# EasyEDA Pro project f1c200s测试板V1.1.eprj, board PCB1
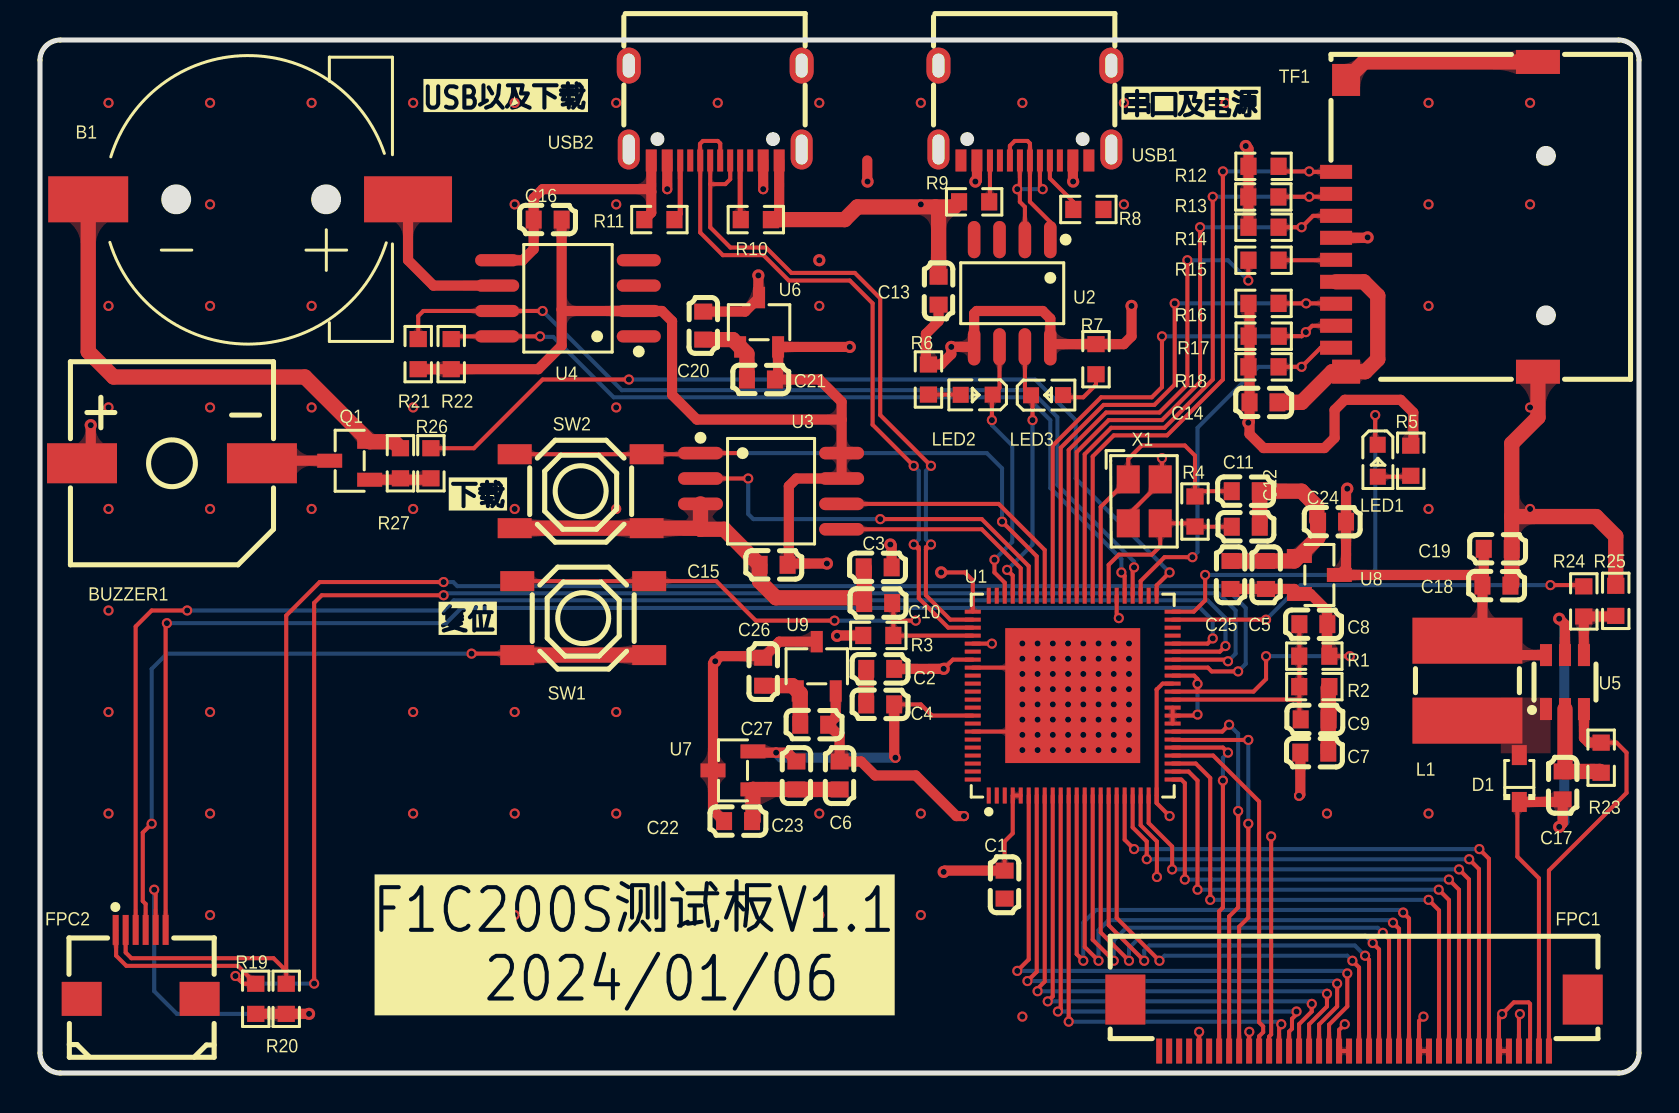
[diagram p1: board, top side]
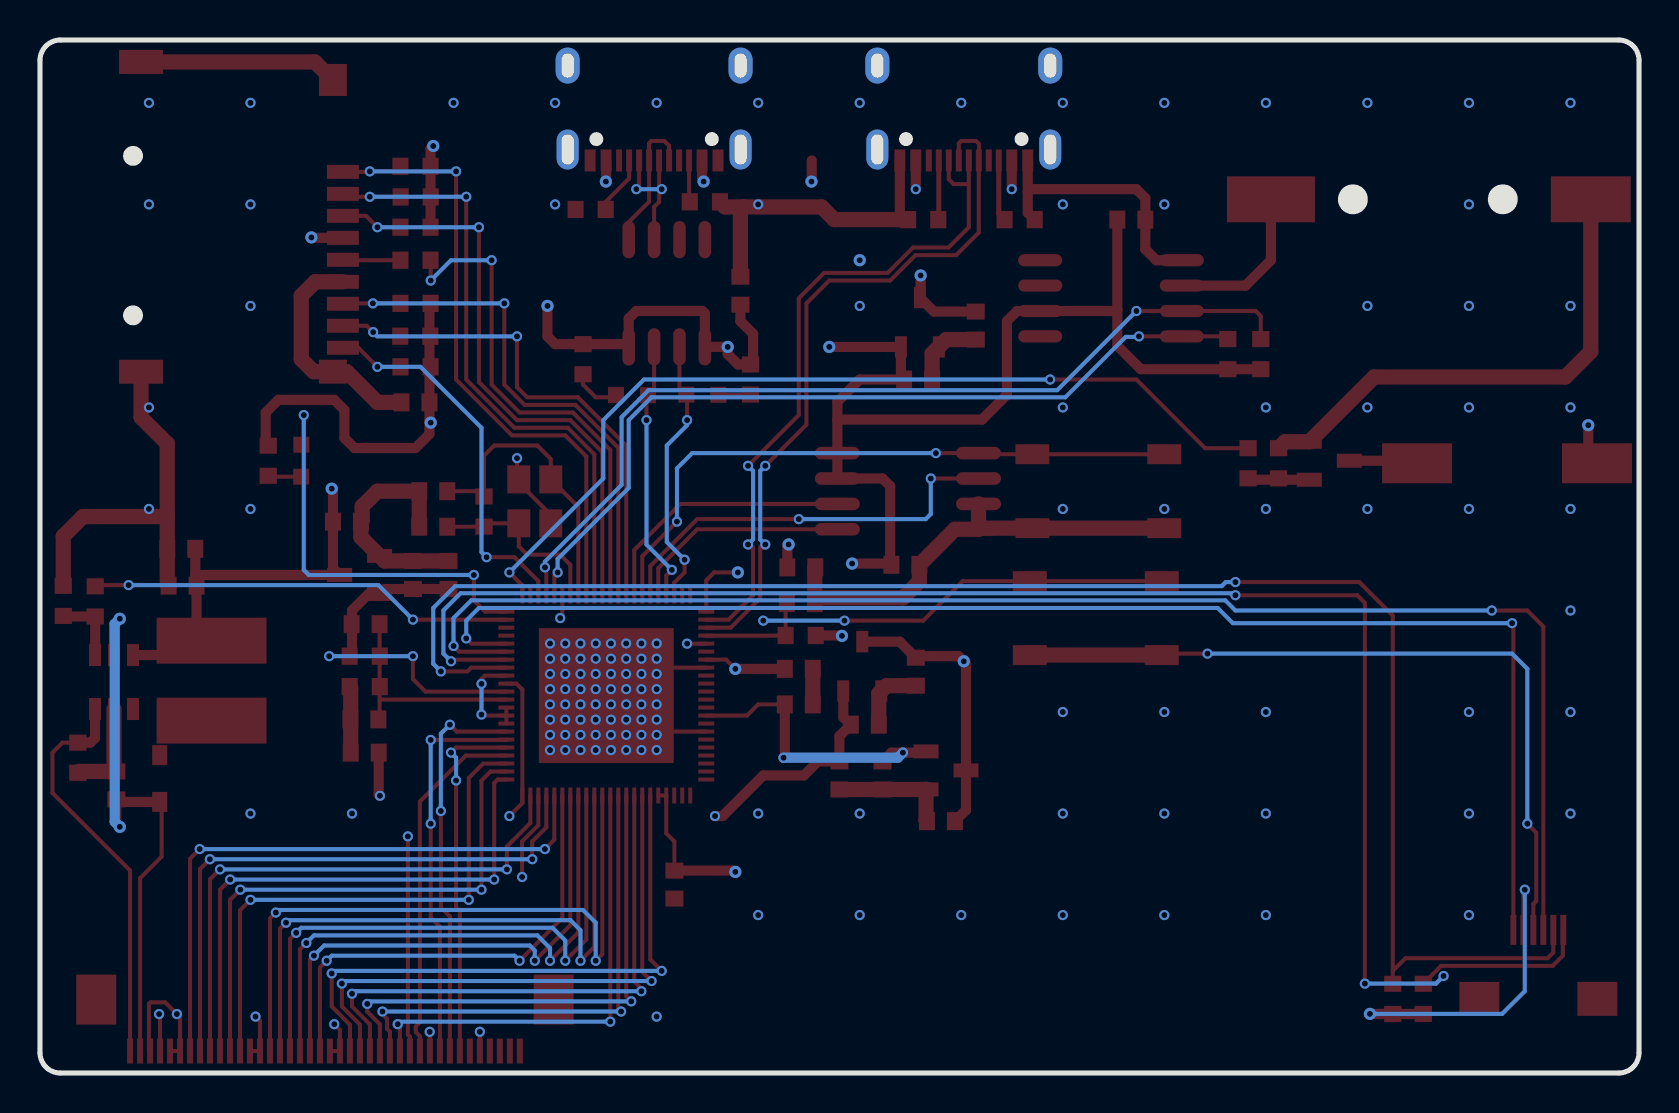
[diagram p2: board, bottom side, seen from below]

Outline 80 x 51.69 mm; copper layers: Top Layer, VCC, GND, Bottom Layer. Coordinates in mm from the lower left corner of the outline.
Outline path: 0,50.67 0,1.02 arc(0.3,0.3) 1.02,0 78.98,0 arc(79.7,0.3) 80,1.02 80,50.67 arc(79.7,51.39) 78.98,51.69 1.02,51.69 arc(0.3,51.39) 0,50.67
Stack: Top Layer 0.035mm 外层铜厚1oz / Dielectric1 0.2104mm 7628 RC49% 8.6mil / VCC 0.0152mm 内层铜厚 / Dielectric2 1.065mm 1.1mm H/HOZ 含铜 / GND 0.0152mm 内层铜厚 / Dielectric3 0.2104mm 7628 RC49% 8.6mil / Bottom Layer 0.035mm 外层铜厚1oz

## Design rules (mm)
template: 自定义配置
spacing copperThickness1oz (default): track to track 0.152, other pairs 0.152 to 0.3
spacing copperThickness2oz: track to track 0.203, other pairs 0.152 to 0.3
track width copperThickness1oz (default): min 0.127, default 0.254, max 2.54
track width copperThickness2oz: min 0.203, default 0.254, max 2.54
differential pair differentialPair (default): width min 0.127, default 0.254, max 2.54; gap min 0.152, default 0.152
via viaSize (default): diameter min 0.5, default 0.508, max 10; hole min 0.305, default 0.305, max 6.299

## Placement (name value [footprint] x y rotation side)
B1  CR1220-2  [BAT-SMD_CR1220-2]  10.41 43.72 180 top
BUZZER1  2700Hz  [BUZ-SMD_L9.6-W9.6-LS10.0-R]  6.6 30.51 180 top
C1  100nF  [C0603]  48.26 9.43 90 top
C2  100nF  [C0603]  42.04 20.22 0 top
C3  100nF  [C0603]  41.91 25.3 0 top
C4  100nF  [C0603]  42.04 18.44 0 top
C5  100nF  [C0603]  61.34 24.92 270 top
C6  100nF  [C0603]  40.01 14.89 90 top
C7  100nF  [C0603]  63.75 16.03 180 top
C8  100nF  [C0603]  63.71 22.46 180 top
C9  100nF  [C0603]  63.77 17.69 180 top
C10  100nF  [C0603]  41.93 23.51 0 top
C11  22pF  [C0603]  60.33 29.11 0 top
C12  22pF  [C0603]  60.33 27.33 180 top
C13  100nF  [C0603]  44.96 39.15 90 top
C14  100nF  [C0603]  61.21 33.56 180 top
C15  100nF  [C0603]  36.7 25.43 180 top
C16  100nF  [C0603]  25.4 42.7 0 top
C17  100nF  [C0603]  76.18 14.39 270 top
C18  100nF  [C0603]  72.87 24.39 180 top
C19  10uF  [C0603]  72.93 26.23 0 top
C20  100nF  [C0603]  33.18 37.4 270 top
C21  10uF  [C0603]  36.07 34.7 0 top
C22  100nF  [C0603]  34.92 12.6 0 top
C23  10uF  [C0603]  37.85 14.89 90 top
C24  100nF  [C0603]  64.64 27.59 180 top
C25  10uF  [C0603]  59.56 24.92 270 top
C26  100nF  [C0603]  36.18 20.08 270 top
C27  10uF  [C0603]  38.73 17.43 0 top
D1  1N5819WS  [SOD-323_L1.8-W1.3-LS2.5-RD]  74.01 14.74 90 top
FPC1  ZX-FPC-FWX0.5PH240  [FPC-SMD_40P-P0.50_MEGASTAR_ZX-FPC-FWX0.5PH240]  65.74 2.39 180 top
FPC2  XW05202-060R-00  [FPC-SMD_XW05202-060R-00]  5.04 5.43 0 top
L1  4.7uH  [IND-SMD_L5.8-W5.2_SLF05XX]  71.42 19.63 90 top
LED1  KT-0603R  [LED0603-RD]  66.93 30.64 270 top
LED2  19-213/Y2C-CQ2R2L/3T(CY)  [LED0603-RD-YELLOW]  46.86 33.94 180 top
LED3  19-217/GHC-YR1S2/3T  [LED0603-RD]  50.38 33.92 0 top
Q1  S9013 J3  [SOT-23-3_L2.9-W1.3-P1.90-LS2.4-BR]  15.49 30.64 0 top
R1  10kΩ  [R0603]  63.75 20.86 180 top
R2  10kΩ  [R0603]  63.75 19.33 180 top
R3  10kΩ  [R0603]  41.94 21.89 180 top
R4  1MΩ  [R0603]  57.79 28.1 270 top
R5  1kΩ  [R0603]  68.58 30.64 270 top
R6  1kΩ  [R0603]  44.45 34.7 270 top
R7  1kΩ  [R0603]  52.83 35.72 270 top
R8  5.1kΩ  [R0603]  52.45 43.21 180 top
R9  5.1kΩ  [R0603]  46.74 43.59 0 top
R10  5.1kΩ  [R0603]  35.81 42.7 180 top
R11  5.1kΩ  [R0603]  30.99 42.7 0 top
R12  10kΩ  [R0603]  61.21 45.37 180 top
R13  10kΩ  [R0603]  61.21 43.84 180 top
R14  10kΩ  [R0603]  61.21 42.32 180 top
R15  33Ω  [R0603]  61.21 40.67 0 top
R16  10kΩ  [R0603]  61.21 38.51 180 top
R17  10kΩ  [R0603]  61.22 36.87 180 top
R18  10kΩ  [R0603]  61.21 35.34 180 top
R19  1kΩ  [R0603]  10.8 3.71 270 top
R20  1kΩ  [R0603]  12.32 3.71 270 top
R21  1kΩ  [R0603]  18.92 35.97 90 top
R22  1kΩ  [R0603]  20.57 35.97 90 top
R23  5.1Ω  [R0603]  78.11 15.78 90 top
R24  1kΩ  [R0603]  77.24 23.6 270 top
R25  10kΩ  [R0603]  78.84 23.63 90 top
R26  1kΩ  [R0603]  19.56 30.51 90 top
R27  10kΩ  [R0603]  18.03 30.51 90 top
SW1  TS-1187A-B-A-B  [SW-SMD_4P-L5.1-W5.1-P3.70-LS6.5-TL-2]  27.18 22.76 0 top
SW2  TS-1187A-B-A-B  [SW-SMD_4P-L5.1-W5.1-P3.70-LS6.5-TL-2]  27.05 29.11 0 top
TF1  TF-CARD H1.8  [TF-SMD_TF-CARD-H1.8]  69.89 42.84 90 top
U1  F1C200S  [QFN-88_L10.0-W10.0-P0.40-BL-EP6.75]  51.67 18.89 0 top
U2  CH340N  [SOP-8_L4.9-W3.9-P1.27-LS6.0-BL]  48.64 39.02 180 top
U3  W25Q128JVSIQ  [SOIC-8_L5.3-W5.3-P1.27-LS8.0-BL]  36.58 29.11 270 top
U4  SD3031  [SOP-8_L5.3-W5.3-P1.27-LS8.0-BL]  26.42 38.76 90 top
U5  MT9284BS6  [SOT-23-6_L2.9-W1.6-P0.95-LS2.8-BR]  76.3 19.56 270 top
U6  XC6206P332MR  [SOT-23-3_L2.9-W1.6-P1.90-LS2.8-BR]  35.98 37.57 270 top
U7  LR6206A-T30  [SOT-23-3_L2.9-W1.3-P1.90-LS2.4-BR]  34.67 15.14 0 top
U8  XC6206P252MR  [SOT-23-3_L2.9-W1.3-P1.90-LS2.4-BR]  64.01 24.92 180 top
U9  LR8103A-T12  [SOT-23-3_L2.9-W1.6-P1.90-LS2.8-BR]  38.86 20.35 270 top
USB1  TYPE-C 16PIN 2MD(073)  [USB-C-SMD_TYPE-C-6PIN-2MD-073]  49.28 48.04 180 top
USB2  TYPE-C 16PIN 2MD(073)  [USB-C-SMD_TYPE-C-6PIN-2MD-073]  33.78 48.04 180 top
X1  24MHz  [CRYSTAL-SMD_4P-L3.2-W2.5-BL-2]  55.24 28.6 270 top

## Footprints (pads in the part's own frame, mm; a bottom-side part is the same pattern mirrored in y, then rotated)
BAT-SMD_CR1220-2
  rect 4.4x2.3 smd: 1(-8,0)
  rect 4x2.3 smd: 2(8,0)
BUZ-SMD_L9.6-W9.6-LS10.0-R
  rect 3.5x2 smd: 1(4.5,0) 2(-4.5,0)
C0603
  rect 0.8x0.9 smd: 1(-0.7,0) 2(0.7,0)
CRYSTAL-SMD_4P-L3.2-W2.5-BL-2
  rect 1.4x1.15 smd: 1(-1.1,-0.8) 2(1.1,-0.8) 3(1.1,0.8) 4(-1.1,0.8)
FPC-SMD_40P-P0.50_MEGASTAR_ZX-FPC-FWX0.5PH240
  rect 0.3x1.25 smd: 1(-9.75,1.288) 2(-9.25,1.288) 3(-8.75,1.288) 4(-8.25,1.288) 5(-7.75,1.288) 6(-7.25,1.288) 7(-6.75,1.288) 8(-6.25,1.288) 9(-5.75,1.288) 10(-5.25,1.288) 11(-4.75,1.288) 12(-4.25,1.288) 13(-3.75,1.288) 14(-3.25,1.288) 15(-2.75,1.288) 16(-2.25,1.288) 17(-1.75,1.288) 18(-1.25,1.288) 19(-0.75,1.288) 20(-0.25,1.288) 21(0.25,1.288) 22(0.75,1.288) 23(1.25,1.288) 24(1.75,1.288) 25(2.25,1.288) 26(2.75,1.288) 27(3.25,1.288) 28(3.75,1.288) 29(4.25,1.288) 30(4.75,1.288) 31(5.25,1.288) 32(5.75,1.288) 33(6.25,1.288) 34(6.75,1.288) 35(7.25,1.288) 36(7.75,1.288) 37(8.25,1.288) 38(8.75,1.288) 39(9.25,1.288) 40(9.75,1.288)
  rect 2x2.5 smd: 41(11.44,-1.288) 42(-11.44,-1.288)
FPC-SMD_XW05202-060R-00
  rect 0.3x1.5 smd: 1(-1.25,1.725) 2(-0.75,1.725) 3(-0.25,1.725) 4(0.25,1.725) 5(0.75,1.725) 6(1.25,1.725)
  rect 2x1.7 smd: 7(2.95,-1.725) 8(-2.95,-1.725)
IND-SMD_L5.8-W5.2_SLF05XX
  rect 2.3x5.5 smd: 1(-2,0) 2(2,0)
LED0603-RD
  rect 0.8x0.8 smd: 1(-0.799,-0.004) 2(0.799,0.004)
LED0603-RD-YELLOW
  rect 0.8x0.8 smd: 1(-0.799,-0.004) 2(0.799,0.004)
QFN-88_L10.0-W10.0-P0.40-BL-EP6.75
  rect 0.2x0.8 smd: 1(-4.2,-5) 2(-3.8,-5) 3(-3.4,-5) 4(-3,-5) 5(-2.6,-5) 6(-2.2,-5) 7(-1.8,-5) 8(-1.4,-5) 9(-1,-5) 10(-0.6,-5) 11(-0.2,-5) 12(0.2,-5) 13(0.6,-5) 14(1,-5) 15(1.4,-5) 16(1.8,-5) 17(2.2,-5) 18(2.6,-5) 19(3,-5) 20(3.4,-5) 21(3.8,-5) 22(4.2,-5) 45(4.2,5) 46(3.8,5) 47(3.4,5) 48(3,5) 49(2.6,5) 50(2.2,5) 51(1.8,5) 52(1.4,5) 53(1,5) 54(0.6,5) 55(0.2,5) 56(-0.2,5) 57(-0.6,5) 58(-1,5) 59(-1.4,5) 60(-1.8,5) 61(-2.2,5) 62(-2.6,5) 63(-3,5) 64(-3.4,5) 65(-3.8,5) 66(-4.2,5)
  rect 0.8x0.2 smd: 23(5,-4.2) 24(5,-3.8) 25(5,-3.4) 26(5,-3) 27(5,-2.6) 28(5,-2.2) 29(5,-1.8) 30(5,-1.4) 31(5,-1) 32(5,-0.6) 33(5,-0.2) 34(5,0.2) 35(5,0.6) 36(5,1) 37(5,1.4) 38(5,1.8) 39(5,2.2) 40(5,2.6) 41(5,3) 42(5,3.4) 43(5,3.8) 44(5,4.2) 67(-5,4.2) 68(-5,3.8) 69(-5,3.4) 70(-5,3) 71(-5,2.6) 72(-5,2.2) 73(-5,1.8) 74(-5,1.4) 75(-5,1) 76(-5,0.6) 77(-5,0.2) 78(-5,-0.2) 79(-5,-0.6) 80(-5,-1) 81(-5,-1.4) 82(-5,-1.8) 83(-5,-2.2) 84(-5,-2.6) 85(-5,-3) 86(-5,-3.4) 87(-5,-3.8) 88(-5,-4.2)
  rect 6.75x6.75 smd: 89(0,0)
R0603
  rect 0.806x0.864 smd: 1(-0.753,0) 2(0.753,0)
SOD-323_L1.8-W1.3-LS2.5-RD
  rect 1x0.75 smd: 1(-1.173,0) 2(1.173,0)
SOIC-8_L5.3-W5.3-P1.27-LS8.0-BL
  oval 0.63x2.25 smd: 1(-1.905,-3.53) 2(-0.635,-3.53) 3(0.635,-3.53) 4(1.905,-3.53) 5(1.905,3.53) 6(0.635,3.53) 7(-0.635,3.53) 8(-1.905,3.53)
SOP-8_L4.9-W3.9-P1.27-LS6.0-BL
  oval 0.63x1.865 smd: 1(-1.905,-2.683) 2(-0.635,-2.683) 3(0.635,-2.683) 4(1.905,-2.683) 5(1.905,2.683) 6(0.635,2.683) 7(-0.635,2.683) 8(-1.905,2.683)
SOP-8_L5.3-W5.3-P1.27-LS8.0-BL
  oval 0.609x2.204 smd: 1(-1.905,-3.542) 2(-0.635,-3.542) 3(0.635,-3.542) 4(1.905,-3.542) 5(1.905,3.542) 6(0.635,3.542) 7(-0.635,3.542) 8(-1.905,3.542)
SOT-23-3_L2.9-W1.3-P1.90-LS2.4-BR
  rect 1.25x0.7 smd: 1(1,-0.95) 2(1,0.95) 3(-1,0)
SOT-23-3_L2.9-W1.6-P1.90-LS2.8-BR
  rect 1.07x0.6 smd: 1(1.235,-0.95) 2(1.235,0.95) 3(-1.235,0)
SOT-23-6_L2.9-W1.6-P0.95-LS2.8-BR
  rect 1.1x0.6 smd: 1(1.35,-0.95) 2(1.35,0) 3(1.35,0.95) 4(-1.35,0.95) 5(-1.35,0) 6(-1.35,-0.95)
SW-SMD_4P-L5.1-W5.1-P3.70-LS6.5-TL-2
  rect 1.7x1 smd: 1(-3.3,1.85) 2(3.3,1.85) 3(-3.3,-1.85) 4(3.3,-1.85)
TF-SMD_TF-CARD-H1.8
  rect 0.7x1.6 smd: 1(2.25,5.05) 2(1.15,5.05) 3(0.05,5.05) 4(-1.05,5.05) 5(-2.15,5.05) 6(-3.25,5.05) 7(-4.35,5.05) 8(-5.45,5.05) 9(-6.55,5.05)
  rect 1.2x1.4 smd: 10(-7.747,4.55)
  rect 1.2x2.2 smd: 11(-7.75,-5.05) 12(7.75,-5.05)
  rect 1.6x1.4 smd: 13(6.85,4.55)
USB-C-SMD_TYPE-C-6PIN-2MD-073
  rect 0.55x1.1 smd: 1(-3.2,2.375) 2(-2.4,2.375) 11(2.4,2.375) 12(3.2,2.375)
  rect 0.3x1.1 smd: 3(-1.75,2.375) 4(-1.25,2.375) 5(-0.75,2.375) 6(-0.25,2.375) 7(0.25,2.375) 8(0.75,2.375) 9(1.25,2.375) 10(1.75,2.375)
  oval 1.1x2 hole 0.6x1.5: 13(-4.325,1.825) 14(4.325,1.825)
  oval 1.2x1.8 hole 0.6x1.2: 13(-4.325,-2.375) 14(4.325,-2.375)

## Nets
As in the schematic.

Pads without a net: FPC1 35 37 38 39 40 41 42; FPC2 7 8; U1 1 2 3 41 42 46 65 66 72 75 76 77 78 79 81 83 84 85 86 87 88; U2 4; U4 1 3 4; USB1 3 9 13 14; USB2 3 9 13 14

## Via types
v1: diameter 0.508, hole 0.305, Top Layer to Bottom Layer, 244 vias
v2: diameter 0.61, hole 0.305, Top Layer to Bottom Layer, 23 vias

## Routing (per net, layer and track width the routed paths; a pad name or vN(x,y) marks a point on that pad's centre or on a via; arc(x,y) is an arc through that point)
+1.2V: length 47.8
  Top Layer w0.203: U1.35 56.17,19.49 55.87,19.19 ; U1.71 v1(47.62,21.49) ; v1(56.52,12.86) 55.87,13.5 U1.22 55.87,19.19 ; 55.87,19.19 55.87,19.2
  Top Layer w0.508: v1(62.99,13.87) 63.05,13.93 C7.2 ; v1(46.23,12.86) 45.85,12.86 43.81,14.89 41.78,14.89 41.08,15.59 C6.2 40.01,16.86 C27.2 39.81,17.81 U9.2
  VCC w0.203: 47.79,12.86 47.62,13.03 v1(47.62,21.49)
  VCC w0.508: v1(46.23,12.86) v1(56.52,12.86) 57.53,12.86 58.55,13.87 v1(62.99,13.87)
+2.5V: length 24.5
  Top Layer w0.203: v1(57.91,17.94) 57.86,17.89 U1.31 ; U1.34 57.89,19.09 ; 57.89,19.09 60.71,19.09 61.34,19.71 v1(61.34,20.86) ; 57.89,19.09 57.91,19.11 57.91,19.71 57.74,19.89 U1.36 ; v1(65.53,20.86) R1.1 ; U1.31 U1.30 ; U1.31 U1.32
  Top Layer w0.508: C25.2 C5.2 62.76,24.22 U8.2 63.56,23.97 64.39,23.14 64.39,20.98 R1.1
  Bottom Layer w0.203: v1(61.34,20.86) v1(65.53,20.86) ; v1(57.91,19.47) v1(57.91,17.94)
+3.0V: length 15.3
  Top Layer w0.203: U1.80 44.63,17.89 44.07,18.44 C4.2
  Top Layer w0.508: U7.2 35.73,16.03 v1(36.83,16.03) 37.4,16.03 C23.2 ; v1(42.8,15.78) 42.74,15.84 C4.2
  Bottom Layer w0.508: v1(36.83,16.03) 37.08,15.78 v1(42.8,15.78)
+3.3V: length 288.8
  Top Layer w0.203: FPC1.31 60.49,2.05 v1(60.5,2.06) ; U1.5 U1.4 48.67,11.99 48.26,11.59 C1.2 ; v2(45.08,25.05) 46.27,25.05 46.67,24.65 U1.67 ; v1(74.04,2.95) 73.99,2.9 FPC1.4 ; U1.20 55.07,12.4 55.88,11.59 v1(55.88,9.81) ; v2(45.21,20.22) 45.67,20.69 U1.73 ; 5.79,7.16 5.79,9.1 v1(5.72,9.17) ; v1(53.98,22.76) 53.87,22.87 U1.50
  Top Layer w0.508: 40.11,32.7 32.86,32.7 31.62,33.94 31.62,37.62 31.11,38.13 U4.2 26.17,38.13 26.1,38.2 ; 40.11,32.7 40.11,33.58 38.99,34.7 C21.2 36.93,34.86 U6.2 v2(40.51,36.33) ; 40.11,32.7 U3.7 37.85,29.75 37.46,29.37 37.46,25.49 ; 60.51,32.6 60.51,31.97 61.21,31.27 64.26,31.27 64.77,31.78 64.77,33.18 65.28,33.68 68.07,33.68 68.71,33.05 68.71,31.52 R5.1 ; 60.51,32.6 C14.2 60.51,38.46 R16.2 ; 60.51,32.6 v2(60.45,32.54) ; C3.2 42.61,26.38 v2(42.55,26.45) ; TF1.4 66.4,41.79 v2(66.42,41.81) ; v2(45.21,10.06) 45.28,10.13 C1.2 ; C2.2 v2(45.21,20.22) ; 37.46,25.49 v2(39.37,25.49) ; 37.46,25.49 C15.1 ; v2(54.61,38.38) 54.61,36.86 54.22,36.47 R7.1 50.68,36.47 U2.8 50.55,37.75 50.17,38.13 46.86,38.13 46.74,38 U2.5 45.6,36.34 v2(45.59,36.33) 45.59,35.97 45.08,35.45 R6.1 44.32,35.58 44.32,36.99 44.96,37.62 C13.1 ; R14.2 R12.2 60.46,46.25 v2(60.33,46.38) ; 26.1,38.2 26.1,36.39 24.93,35.22 R22.1 R21.1 ; 26.1,38.2 C16.2 ; R19.2 R20.2 v2(13.46,2.96) ; R3.2 39.9,21.89 v2(39.88,21.87)
  VCC w0.203: v1(53.98,22.76) 45.21,22.76
  VCC w0.508: v2(66.42,41.81) 66.42,45.37 65.4,46.38 v2(60.33,46.38) 58.04,46.38 56.26,44.61 56.26,39.59 56.2,39.53 ; 56.2,39.53 58.29,39.53 60.45,37.37 v2(60.45,32.54) ; 56.2,39.53 55.75,39.53 v2(54.61,38.38) ; 45.21,21.87 v2(45.21,20.22) v2(45.21,10.06) ; 45.21,21.87 v2(39.88,21.87) ; 45.21,21.87 45.21,24.92 44.96,25.18 43.05,25.18 42.55,25.68 v2(42.55,26.45) 39.75,26.45 39.37,26.06 v2(39.37,25.49) ; v2(40.51,36.33) v2(45.59,36.33) ; v2(45.21,10.06) 45.34,10.19 47.5,10.19 47.88,9.81 v1(55.88,9.81) 57.91,7.78 57.91,6 60.5,3.41 v1(60.5,2.06) 61.27,1.3 72.9,1.3 74.04,2.44 v1(74.04,2.95) ; v2(45.21,10.06) 45.21,3.97 44.2,2.96 v2(13.46,2.96)
  Bottom Layer w0.203: v1(5.72,9.17) 5.72,4.09 6.85,2.96 v2(13.46,2.96)
+5V: length 162
  Top Layer w0.508: v2(46.8,44.61) 46.88,44.68 USB1.11 ; C20.1 35.27,38.1 U6.3 35.94,38.84 v2(35.94,39.91) ; v2(51.69,44.61) 51.68,44.62 USB1.2 ; 72.23,24.98 72.23,24.45 C18.2 72.17,22.38 L1.2 72.14,20.91 U5.6 ; 72.23,24.98 72.17,24.92 65.34,24.92 ; 72.23,24.98 C19.1 ; 41.39,45.66 41.39,44.62 v2(41.4,44.61) ; BUZZER1.1 2.54,30.95 v2(2.54,32.41) ; USB2.2 v1(36.18,44.23) ; USB2.11 v1(31.38,44.23) ; U8.3 65.34,25.26 C24.1 65.34,29.18 v2(65.4,29.24) ; U9.3 36.98,21.58 C26.1 36.1,20.86 34.04,20.86 33.67,20.49 U7.3 33.67,13.16 C22.1
  VCC w0.508: 39,44.23 v1(36.18,44.23) v1(31.38,44.23) ; 39,44.23 38.99,44.21 v2(38.99,40.67) 36.7,40.67 v2(35.94,39.91) 35.94,33.3 35.05,32.41 33.09,32.41 ; 39,44.23 41.02,44.23 v2(41.4,44.61) v2(46.8,44.61) 47.12,44.61 47.62,45.11 50.55,45.11 51.05,44.61 v2(51.69,44.61) 54.48,44.61 57.28,47.4 65.66,47.4 67.56,45.5 67.56,35.84 65.4,33.68 v2(65.4,29.24) ; 33.09,32.41 v2(2.54,32.41) ; 33.09,32.41 33.09,21.3 v2(33.78,20.6)
GND: length 230
  Top Layer w0.203: v1(69.21,2.82) 68.99,2.6 FPC1.14 FPC1.13 ; FPC1.29 61.49,1.83 61.59,1.93 v1(61.59,11.84) ; FPC1.5 FPC1.6 72.99,2.79 v1(73.15,2.95) 73.74,3.54 74.47,3.54 74.55,3.46 74.55,1.16 FPC1.3 ; 23.88,20.91 23.81,20.98 v1(21.59,20.98) ; FPC1.21 FPC1.22 64.99,2.16 v1(65.28,2.44) ; v1(5.59,12.48) 5.14,12.03 5.14,8.6 5.29,8.46 5.29,7.16 ; X1.2 54.45,27.93 56.05,29.53 X1.4 56.13,29.79 v1(56.13,30.76) ; U1.82 49.87,17.09 U1.89 50.27,20.29 U1.74 ; FPC1.36 v1(57.99,2.06)
  Top Layer w0.508: R11.1 30.58,43.05 30.58,44.09 ; USB2.1 36.98,42.77 37.05,42.7 ; 30.58,44.09 30.44,44.23 25.15,44.23 24.7,43.78 C16.1 24.7,41.22 24.15,40.67 U4.5 ; 30.58,44.09 USB2.12
  Top Layer w0.762: 73.63,27.84 C19.2 73.63,24.45 C18.1 ; 73.63,27.84 73.64,27.84 77.85,27.84 78.84,26.86 R25.2 ; 73.63,27.84 73.63,31.5 74.94,32.81 TF1.11 ; C13.2 44.96,43.18 44.8,43.34 ; U3.4 32.99,27.26 SW2.4 SW2.3 ; U3.4 U3.3 ; U3.4 34.23,27.21 C15.2 36,24.6 36.82,23.78 40.97,23.78 C10.1 41.23,25.28 C3.1 ; C12.1 C11.2 63.12,29.11 63.88,28.35 63.88,27.65 C24.2 63.94,26.81 U8.1 62.76,25.62 C5.1 C25.1 ; C6.1 C23.1 35.67,14.19 U7.1 35.67,12.65 C22.2 ; U5.2 76.3,15.21 C17.1 78.04,15.09 R23.1 ; C7.1 64.45,19.28 R2.1 ; C2.1 C4.1 ; B1.2 2.41,36.1 3.68,34.83 13.25,34.83 Q1.2 17.71,31.59 R27.2 ; R9.1 45.73,43.34 44.8,43.34 ; C21.1 35.37,35.99 U6.1 34.66,36.7 C20.2 ; 44.8,43.34 40.89,43.34 40.26,42.7 R10.1 ; 61.91,33.56 63.12,33.56 64.65,35.09 TF1.10 66.31,35.09 66.93,35.72 66.93,38.89 66.23,39.59 TF1.6 ; 23.88,20.91 SW1.4 ; TF1.12 66.24,50.59 TF1.13 ; C26.2 37.65,19.38 38.04,18.99 C27.1
  Bottom Layer w0.203: v1(21.59,20.98) 6.35,20.98 5.59,20.22 v1(5.59,12.48)
  vias: v1(3.43,48.54) v1(3.43,38.38) v1(3.43,33.3) v1(3.43,28.22) v1(3.43,23.14) v1(3.43,18.06) v1(3.43,12.98) v1(8.51,48.54) v1(8.51,43.46) v1(8.51,38.38) v1(8.51,33.3) v1(8.51,28.22) v1(8.51,18.06) v1(8.51,12.98) v1(8.51,7.9) v1(13.59,48.54) v1(13.59,38.38) v1(13.59,33.3) v1(13.59,28.22) v1(18.67,48.54) v1(18.67,33.3) v1(18.67,28.22) v1(18.67,18.06) v1(18.67,12.98) v1(18.67,7.9) v1(23.75,48.54) v1(23.75,43.46) v1(23.75,28.22) v1(23.75,18.06) v1(23.75,12.98) v1(23.75,7.9) v1(28.83,48.54) v1(28.83,43.46) v1(28.83,33.3) v1(28.83,28.22) v1(28.83,18.06) v1(28.83,12.98) v1(28.83,7.9) v1(33.91,48.54) v1(33.91,7.9) v1(38.99,48.54) v1(38.99,38.38) v1(38.99,12.98) v1(38.99,7.9) v1(44.07,48.54) v1(44.07,43.46) v1(44.07,12.98) v1(44.07,7.9) v1(49.15,48.54) v1(49.15,21.49) v1(49.15,20.73) v1(49.15,19.97) v1(49.15,19.21) v1(49.15,18.44) v1(49.15,17.68) v1(49.15,16.92) v1(49.15,16.16) v1(49.15,2.82) v1(49.91,21.49) v1(49.91,20.73) v1(49.91,19.97) v1(49.91,19.21) v1(49.91,18.44) v1(49.91,17.68) v1(49.91,16.92) v1(49.91,16.16) v1(50.67,21.49) v1(50.67,20.73) v1(50.67,19.97) v1(50.67,19.21) v1(50.67,18.44) v1(50.67,17.68) v1(50.67,16.92) v1(50.67,16.16) v1(51.43,21.49) v1(51.43,20.73) v1(51.43,19.97) v1(51.43,19.21) v1(51.43,18.44) v1(51.43,17.68) v1(51.43,16.92) v1(51.43,16.16) v1(52.2,21.49) v1(52.2,20.73) v1(52.2,19.97) v1(52.2,19.21) v1(52.2,18.44) v1(52.2,17.68) v1(52.2,16.92) v1(52.2,16.16) v1(52.96,21.49) v1(52.96,20.73) v1(52.96,19.97) v1(52.96,19.21) v1(52.96,18.44) v1(52.96,17.68) v1(52.96,16.92) v1(52.96,16.16) v1(53.72,21.49) v1(53.72,20.73) v1(53.72,19.97) v1(53.72,19.21) v1(53.72,18.44) v1(53.72,17.68) v1(53.72,16.92) v1(53.72,16.16) v1(54.23,48.54) v1(54.23,43.46) v1(54.48,21.49) v1(54.48,20.73) v1(54.48,19.97) v1(54.48,19.21) v1(54.48,18.44) v1(54.48,17.68) v1(54.48,16.92) v1(54.48,16.16) v1(59.31,48.54) v1(64.39,12.98) v1(69.47,48.54) v1(69.47,43.46) v1(69.47,38.38) v1(69.47,28.22) v1(69.47,12.98) v1(74.55,48.54) v1(74.55,43.46) v1(74.55,33.3) v1(74.55,28.22)
$B1_1: length 8
  Top Layer w0.508: U4.6 19.68,39.4 18.41,40.67 B1.1
$BUZZER1_2: length 3.4
  Top Layer w0.508: BUZZER1.2 11.23,30.64 14.49,30.64
$LED1_2: length 1.7
  Top Layer w0.203: LED1.2 68.53,29.84 R5.2
$LED2_2: length 1.6
  Top Layer w0.203: R6.2 46.05,33.95 LED2.2
$LED3_2: length 2.5
  Top Layer w0.203: LED3.2 51.29,33.81 52.2,33.81 52.83,34.45 R7.2
$Q1_1: length 3.1
  Top Layer w0.508: R26.1 19.49,29.69 Q1.1
$R8_2: length 2.9
  Top Layer w0.203: USB1.4 50.53,44.76 51.7,43.59 R8.2
$R9_2: length 2.1
  Top Layer w0.203: USB1.10 47.53,43.63 R9.2
$R10_2: length 3
  Top Layer w0.254: R10.2 35.03,42.73 USB2.4
$R11_2: length 3.1
  Top Layer w0.254: USB2.10 32.03,42.99 R11.2
$R15_2: length 2.9
  Top Layer w0.203: R15.2 64.82,40.67 TF1.5
$R24_2: length 3.5
  Top Layer w0.508: U5.4 77.24,20.92 R24.2 78.81,22.84 R25.1
BUZZER: length 45.5
  Top Layer w0.203: U1.45 55.87,24.4 v1(56.52,25.05) ; v1(29.46,34.7) 25.15,34.7 21.71,31.26 R26.2
  Bottom Layer w0.203: v1(56.52,25.05) 51.82,29.75 51.82,32.67 49.78,34.7 v1(29.46,34.7)
CH340N_D+: length 7.1
  Top Layer w0.203: USB1.8 48.53,46.4 48.77,46.64 49.4,46.64 49.53,46.51 49.53,45.66 USB1.6 49.53,43.59 50.55,42.57 U2.1
CH340N_D-: length 6.8
  Top Layer w0.203: USB1.7 49.02,45.66 49.02,43.59 49.28,43.34 U2.2 ; USB1.5 50.03,44.36 v1(50.17,44.23)
  Bottom Layer w0.203: v1(48.89,44.23) v1(50.17,44.23)
GT911_INT: length 74.8
  Top Layer w0.203: v1(59.31,21.37) 59.03,21.09 U1.39 ; 4.79,7.16 4.79,22.34 5.59,23.14 v1(7.37,23.14)
  Bottom Layer w0.203: v1(59.31,21.37) 59.31,22.76 58.42,23.65 20.7,23.65 20.19,23.14 v1(7.37,23.14)
GT911_RST: length 71.3
  Top Layer w0.203: v1(6.35,22.51) 6.29,22.45 6.29,7.16 ; U1.40 58.41,21.49 v1(58.67,21.75)
  Bottom Layer w0.203: v1(58.67,21.75) 58.67,22.64 58.04,23.27 21.08,23.27 20.32,22.51 v1(6.35,22.51)
IIC0_SCL: length 85.3
  Top Layer w0.203: 3.79,7.16 3.81,7.14 3.81,5.87 4.32,5.36 9.9,5.36 R19.1 10.17,4.47 v1(9.78,4.86) ; v1(59.44,20.6) 59.35,20.69 U1.38 ; v1(20.19,23.91) 14.1,23.91 13.72,23.52 v1(13.72,4.47)
  Bottom Layer w0.203: v1(20.19,23.91) 20.29,24.01 58.95,24.01 59.82,23.14 59.82,20.98 v1(59.44,20.6) ; v1(9.78,4.86) 10.16,4.47 v1(13.72,4.47)
IIC0_SDA: length 83.9
  Top Layer w0.203: U1.37 58.43,20.29 58.62,20.1 v1(59.94,20.1) ; 12.32,5.11 R20.1 ; 12.32,5.11 11.68,5.74 4.57,5.74 4.29,6.03 4.29,7.16 ; 12.32,5.11 12.32,22.89 14,24.57 v1(20.19,24.57)
  Bottom Layer w0.203: v1(20.19,24.57) 20.68,24.57 20.88,24.36 59.23,24.36 60.33,23.27 60.33,20.48 v1(59.94,20.1)
IIC2_SCL: length 42.1
  Top Layer w0.203: v1(25.02,36.86) 20.71,36.86 R22.2 ; U1.49 54.27,24.88 v1(54.1,25.05)
  Bottom Layer w0.203: v1(25.02,36.86) 25.04,36.83 25.68,36.83 28.7,33.81 49.4,33.81 50.55,32.67 50.55,29.27 54.1,25.72 v1(54.1,25.05)
IIC2_SDA: length 46
  Top Layer w0.203: v1(25.15,38.13) U4.7 19.18,38.13 18.92,37.88 R21.2 ; U1.48 54.67,25.23 v1(54.74,25.3)
  Bottom Layer w0.203: v1(25.15,38.13) 29.11,34.17 49.55,34.17 50.9,32.82 50.9,29.43 54.74,25.59 v1(54.74,25.3)
LCD_BL: length 21.3
  Top Layer w0.203: U1.43 v1(61.34,22.69) ; v1(75.56,24.41) 77.17,24.41 R24.1
  Bottom Layer w0.203: v1(61.34,22.69) 63.07,24.41 v1(75.56,24.41)
LCD_CLK: length 17.9
  Top Layer w0.203: FPC1.30 60.99,1.84 61.2,2.04 61.2,2.33 60.99,2.54 60.99,13.59 58.69,15.89 U1.26
LCD_D2: length 29.8
  Top Layer w0.203: v1(48.89,5.11) 49.47,5.68 U1.6 ; v1(65.4,4.98) 65.4,3.33 64.49,2.42 FPC1.23
  Bottom Layer w0.203: v1(48.89,5.11) 65.28,5.11 v1(65.4,4.98)
LCD_D3: length 28.8
  Top Layer w0.203: FPC1.24 63.99,2.43 64.9,3.33 v1(64.9,4.47) ; v1(49.4,4.6) 49.87,5.07 U1.7
  Bottom Layer w0.203: v1(49.4,4.6) 64.77,4.6 v1(64.9,4.47)
LCD_D4: length 27.7
  Top Layer w0.203: v1(49.91,4.09) 49.91,4.22 50.27,4.58 U1.8 ; v1(64.39,3.97) 64.39,3.33 63.49,2.44 FPC1.25
  Bottom Layer w0.203: v1(64.39,3.97) 64.26,4.09 v1(49.91,4.09)
LCD_D5: length 26.3
  Top Layer w0.203: FPC1.26 62.99,2.44 63.63,3.08 v1(63.63,3.46) ; U1.9 50.67,3.83 v1(50.42,3.59)
  Bottom Layer w0.203: v1(50.42,3.59) 63.5,3.59 v1(63.63,3.46)
LCD_D6: length 24.9
  Top Layer w0.203: 62.93,3.01 62.64,2.71 62.64,2.22 62.49,2.07 FPC1.27 ; U1.10 51.07,3.22 v1(50.93,3.08)
  Bottom Layer w0.203: v1(50.93,3.08) v1(62.86,3.08)
LCD_D7: length 23.4
  Top Layer w0.203: v1(62.1,2.44) 61.99,2.33 FPC1.28 ; v1(51.47,2.57) U1.11
  Bottom Layer w0.203: v1(62.1,2.44) 61.98,2.57 v1(51.47,2.57)
LCD_D10: length 33.7
  Top Layer w0.203: v1(52.2,5.62) 51.87,5.95 U1.12 ; v1(68.2,8.03) 68.49,7.74 FPC1.15
  Bottom Layer w0.203: v1(52.2,5.62) 52.2,7.52 52.83,8.16 68.07,8.16 v1(68.2,8.03)
LCD_D11: length 31.6
  Top Layer w0.203: v1(67.69,7.52) 67.99,7.22 FPC1.16 ; U1.13 52.27,6.31 v1(52.96,5.62)
  Bottom Layer w0.203: v1(67.69,7.52) 67.56,7.65 53.47,7.65 52.96,7.14 v1(52.96,5.62)
LCD_D12: length 29.6
  Top Layer w0.203: v1(67.18,7.01) 67.49,6.7 FPC1.17 ; v1(53.72,5.62) 52.67,6.67 U1.14
  Bottom Layer w0.203: v1(53.72,5.62) 53.72,6.63 54.36,7.27 66.93,7.27 v1(67.18,7.01)
LCD_D13: length 27.6
  Top Layer w0.203: FPC1.18 66.99,6.19 v1(66.67,6.51) ; v1(54.48,5.62) 53.07,7.03 U1.15
  Bottom Layer w0.203: v1(54.48,5.62) 54.48,6.25 55.12,6.89 66.29,6.89 v1(66.67,6.51)
LCD_D14: length 25.7
  Top Layer w0.203: FPC1.19 66.49,5.67 v1(66.29,5.87) ; U1.16 53.47,7.4 v1(55.24,5.62)
  Bottom Layer w0.203: v1(55.24,5.62) 55.24,6.13 55.5,6.38 65.79,6.38 v1(66.29,5.87)
LCD_D15: length 23.7
  Top Layer w0.203: FPC1.20 65.99,5.28 v1(65.66,5.62) ; U1.17 53.87,7.76 v1(56.01,5.62)
  Bottom Layer w0.203: v1(56.01,5.62) 56.26,5.87 65.4,5.87 v1(65.66,5.62)
LCD_D18: length 30.5
  Top Layer w0.203: FPC1.7 72.49,10.72 v1(72.01,11.21) ; U1.18 54.27,11.68 v1(54.74,11.21)
  Bottom Layer w0.203: v1(54.74,11.21) v1(72.01,11.21)
LCD_D19: length 29.4
  Top Layer w0.203: FPC1.8 71.99,10.21 v1(71.5,10.7) ; v1(55.37,10.7) 55.37,11.59 54.67,12.29 U1.19
  Bottom Layer w0.203: v1(55.37,10.7) v1(71.5,10.7)
LCD_D20: length 27.8
  Top Layer w0.203: FPC1.9 71.49,9.69 v1(70.99,10.19) ; U1.21 55.47,12.51 56.64,11.33 v1(56.64,10.19)
  Bottom Layer w0.203: v1(56.64,10.19) v1(70.99,10.19)
LCD_D21: length 27.5
  Top Layer w0.203: v1(70.48,9.68) 70.99,9.17 FPC1.10 ; v1(57.28,9.68) 57.28,14.51 57.1,14.69 U1.23
  Bottom Layer w0.203: v1(70.48,9.68) v1(57.28,9.68)
LCD_D22: length 27.2
  Top Layer w0.203: v1(57.91,9.17) 57.91,14.63 57.46,15.09 U1.24 ; FPC1.11 70.49,8.66 v1(69.98,9.17)
  Bottom Layer w0.203: v1(57.91,9.17) v1(69.98,9.17)
LCD_D23: length 27
  Top Layer w0.203: v1(69.47,8.67) 69.99,8.14 FPC1.12 ; U1.25 57.82,15.49 58.55,14.76 v1(58.55,8.67)
  Bottom Layer w0.203: v1(69.47,8.67) v1(58.55,8.67)
LCD_DE: length 18
  Top Layer w0.203: v1(59.18,14.63) 59.18,8.28 58.99,8.1 FPC1.34 ; U1.27 59.18,16.29 v1(59.44,16.03)
  Bottom Layer w0.203: v1(59.18,14.63) 59.18,15.78 v1(59.44,16.03)
LCD_HSYNC: length 19.6
  Top Layer w0.203: U1.28 56.69,16.67 v1(60.45,16.67) ; v1(60.45,12.48) 60.45,7.78 59.99,7.32 FPC1.32
  Bottom Layer w0.203: v1(60.45,16.67) v1(60.45,12.48)
LCD_VSYNC: length 19.7
  Top Layer w0.203: v1(59.49,17.43) 59.15,17.09 U1.29 ; v1(59.94,13.11) 59.94,8.28 59.49,7.83 FPC1.33
  Bottom Layer w0.203: v1(59.49,17.43) 59.94,16.98 v1(59.94,13.11)
LED_GND: length 20.4
  Top Layer w0.203: R23.2 78.88,16.53 79.37,16.03 79.37,14.02 75.49,10.14 FPC1.1
  Top Layer w0.508: R23.2 77.48,16.53 77.25,16.76 U5.3
LED_VCC: length 29.2
  Top Layer w0.203: D1.1 73.91,13.47 73.91,10.82 74.99,9.75 FPC1.2
  Top Layer w0.508: U5.5 76.3,22.44 v2(76.01,22.73) ; D1.1 76.05,13.56 C17.2 76.18,12.49 v2(76.01,12.32)
  Bottom Layer w0.508: v2(76.01,22.73) 76.26,22.48 76.26,12.57 v2(76.01,12.32)
NRST: length 27.5
  Top Layer w0.203: v1(43.81,22.64) 42.71,22.64 42.7,22.62 ; 42.7,22.62 42.7,23.45 C10.2 ; 42.7,22.62 R3.1 42.7,21.89 U1.70 ; v1(39.75,22.64) 35.81,22.64 33.84,24.61 SW1.2 23.88,24.61
  Bottom Layer w0.203: v1(39.75,22.64) v1(43.81,22.64)
SDIO_CD: length 20.1
  Top Layer w0.203: R18.1 v1(63.12,35.34) 64.07,36.29 TF1.9 ; v1(57.66,25.81) 56.26,25.81 55.07,24.62 U1.47
  Bottom Layer w0.203: v1(57.66,25.81) 57.91,26.06 57.91,32.29 60.96,35.34 v1(63.12,35.34)
SDIO_CK: length 25.3
  Top Layer w0.203: R15.1 60.45,40.66 v1(60.45,39.65) ; v1(57.4,40.67) 57.4,34.45 56.01,33.05 53.34,33.05 51.47,31.18 U1.56
  Bottom Layer w0.203: v1(57.4,40.67) 59.44,40.67 v1(60.45,39.65)
SDIO_CMD: length 30.7
  Top Layer w0.203: v1(58.04,42.32) 58.04,34.57 56.13,32.67 53.47,32.67 51.87,31.07 U1.55 ; TF1.3 63.69,42.89 v1(63.12,42.32) R14.1
  Bottom Layer w0.203: v1(63.12,42.32) v1(58.04,42.32)
SDIO_D0: length 27.9
  Top Layer w0.203: R16.1 v1(63.35,38.51) 64.82,38.51 TF1.7 ; U1.57 51.07,31.28 53.21,33.43 55.75,33.43 56.77,34.45 v1(56.77,38.51)
  Bottom Layer w0.203: v1(56.77,38.51) v1(63.35,38.51)
SDIO_D1: length 27.1
  Top Layer w0.203: TF1.8 63.65,37.39 v1(63.33,37.07) 63.13,36.87 61.98,36.87 ; v1(56.13,36.86) 56.13,34.32 55.63,33.81 53.09,33.81 50.67,31.39 U1.58
  Bottom Layer w0.203: v1(56.13,36.86) 63.12,36.86 v1(63.33,37.07)
SDIO_D2: length 32.8
  Top Layer w0.203: U1.53 52.67,30.85 53.72,31.91 56.39,31.91 59.18,34.7 v1(59.18,45.11) ; TF1.1 63.52,45.09 v1(63.5,45.11) 62.22,45.11 R12.1
  Bottom Layer w0.203: v1(59.18,45.11) v1(63.5,45.11)
SDIO_D3: length 32
  Top Layer w0.203: R13.1 61.97,43.84 v1(63.5,43.84) 64.7,43.84 TF1.2 ; v1(58.67,43.84) 58.67,34.7 56.26,32.29 53.59,32.29 52.27,30.96 U1.54
  Bottom Layer w0.203: v1(58.67,43.84) v1(63.5,43.84)
SPI0_CS: length 31.8
  Top Layer w0.203: v1(48.13,27.59) 49.87,25.85 U1.60 ; v1(35.18,31.02) 33.05,31.02 32.99,30.96 SW2.2 SW2.1
  Bottom Layer w0.203: v1(35.18,31.02) 47.37,31.02 48.13,30.26 v1(48.13,27.59)
SPI0_MISO: length 20.8
  Top Layer w0.203: U1.61 49.47,25.37 47.12,27.72 v1(42.04,27.72) ; v1(35.43,29.75) U3.2
  Bottom Layer w0.203: v1(42.04,27.72) 35.69,27.72 35.43,27.97 v1(35.43,29.75)
SPI0_MOSI: length 11.1
  Top Layer w0.203: U1.62 49.07,25.26 47.12,27.21 U3.5
SPI0_SCK: length 13.4
  Top Layer w0.203: U1.59 50.27,26.17 47.96,28.48 U3.6
SVREF: length 11.2
  Top Layer w0.203: 63.01,18.62 63.01,17.76 C9.2 ; 63.01,18.62 C8.2 ; 63.01,18.62 62.94,18.69 U1.33
UART1_RX: length 13.6
  Top Layer w0.203: v1(47.75,25.68) 47.75,25.05 48.27,24.53 U1.64 ; U2.6 48.01,34.29 LED2.1 47.62,33.9 v1(47.62,32.67)
  Bottom Layer w0.203: v1(47.75,25.68) 48.64,26.57 48.64,31.4 47.62,32.41 v1(47.62,32.67)
UART1_TX: length 13.3
  Top Layer w0.203: v1(48.39,25.18) 48.67,24.9 U1.63 ; v1(49.66,32.67) 49.66,33.84 LED3.1 49.28,34.22 U2.7
  Bottom Layer w0.203: v1(49.66,32.67) 49.66,26.45 v1(48.39,25.18)
USB_DN: length 34.6
  Top Layer w0.203: 44.32,26.19 44.32,26.32 ; 44.32,26.19 v1(44.58,26.45) ; 44.32,26.19 44.32,23.91 45.54,22.69 U1.68 ; 33.53,44.48 USB2.7 ; 33.53,44.48 34.29,44.48 34.53,44.72 USB2.5 ; 33.53,44.48 33.53,42.32 34.54,41.3 36.32,41.3 37.59,40.03 40.77,40.03 42.04,38.76 42.04,32.92 v1(44.58,30.38)
  Bottom Layer w0.203: v1(44.58,30.38) 44.32,30.13 44.32,26.7 v1(44.58,26.45)
USB_DP: length 35.9
  Top Layer w0.203: 43.97,26.19 v1(43.71,26.45) ; 43.97,26.19 43.97,23.76 45.44,22.29 U1.69 ; 43.97,26.19 43.97,26.32 ; USB2.6 34.03,46.52 33.91,46.64 33.17,46.64 33.02,46.49 33.02,45.67 USB2.8 33.03,42.05 34.16,40.92 36.2,40.92 37.46,39.65 40.51,39.65 41.66,38.51 41.66,32.44 v1(43.71,30.38)
  Bottom Layer w0.203: v1(43.71,30.38) 43.97,30.13 43.97,26.7 v1(43.71,26.45)
WORK_LED: length 21
  Top Layer w0.203: v1(58.29,24.92) 58.29,23.65 57.73,23.09 U1.44 ; v1(66.8,32.92) 66.8,31.56 LED1.1
  Bottom Layer w0.203: v1(66.8,32.92) 66.8,25.18 66.55,24.92 v1(58.29,24.92)
XI: length 9.3
  Top Layer w0.203: U1.51 53.47,25.43 53.98,25.94 55.63,25.94 56.05,26.36 X1.3 57.62,27.5 R4.2 57.79,27.33 C12.2
XO: length 15.2
  Top Layer w0.203: C11.1 58.05,29.11 R4.1 57.79,30.89 57.28,31.4 55.12,31.4 54.45,30.73 X1.1 53.07,28.33 U1.52

## Copper pours and planes (outline as drawn; the poured copper is in the pictures)
+1.2V on VCC: 45.95,21.89 64.01,21.89 64.01,11.59 45.95,11.59
+3.3V on VCC: 12.83,0.92 75.18,0.92 75.18,10.86 45.85,10.86 45.85,22.41 63.72,22.41 63.72,34.06 66.93,37.28 66.93,45.24 65.39,46.78 57.66,46.78 53.56,42.68 38.82,42.68 38.82,5.24 12.83,5.24
+5V on VCC: 38.01,6.25 1.45,6.25 1.45,49.94 70.36,49.94 70.36,28.86 65.33,28.86 65.02,29.18 65.02,33.8 67.18,35.97 67.18,45.5 65.53,47.15 57.55,47.15 53.72,43.31 38.01,43.31
GND on Top Layer: -1.65,55.4 82.3,55.4 82.3,-2.26 -1.65,-2.26
GND on Bottom Layer: -1.65,55.4 82.3,55.4 82.3,-2.26 -1.65,-2.26
GND on GND: 0.26,51.43 79.74,51.43 79.74,0.26 0.26,0.26
$D1_2 on Top Layer: 73.09,18.79 75.58,18.79 75.58,16 73.09,16

Small or netless copper shapes (teardrops, artwork), in the pictures only: 474 on Top Layer, 100 on Bottom Layer, 15 on VCC

## Text on the board
Top Silkscreen Layer: USB以及下载 | 复位 | 下载 | 串口及电源 | F1C200S测试板V1.1 / 2024/01/06
